# Altium schematic sheet Sheet9.SchDoc
size A4
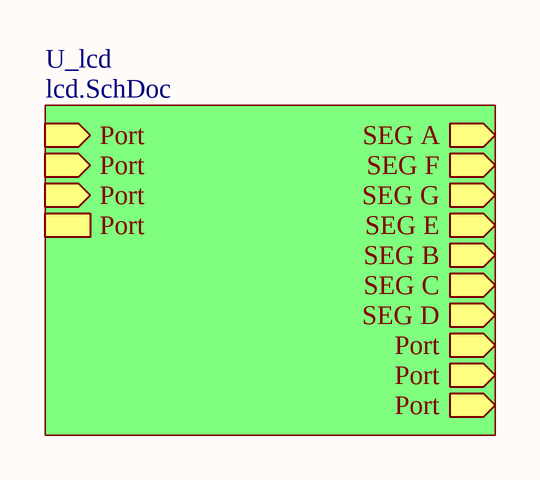
[diagram p0: Sheet9.SchDoc]

## Sub-sheets
U_lcd = lcd.SchDoc: Port (in), Port (in), Port (in), SEG A (out), SEG F (out), SEG G (out), SEG E (out), SEG B (out), SEG C (out), SEG D (out), Port (out), Port (out), Port (out), Port